# EAGLE schematic tsar_SensorFrontEnd (EAGLE 9.5.1)
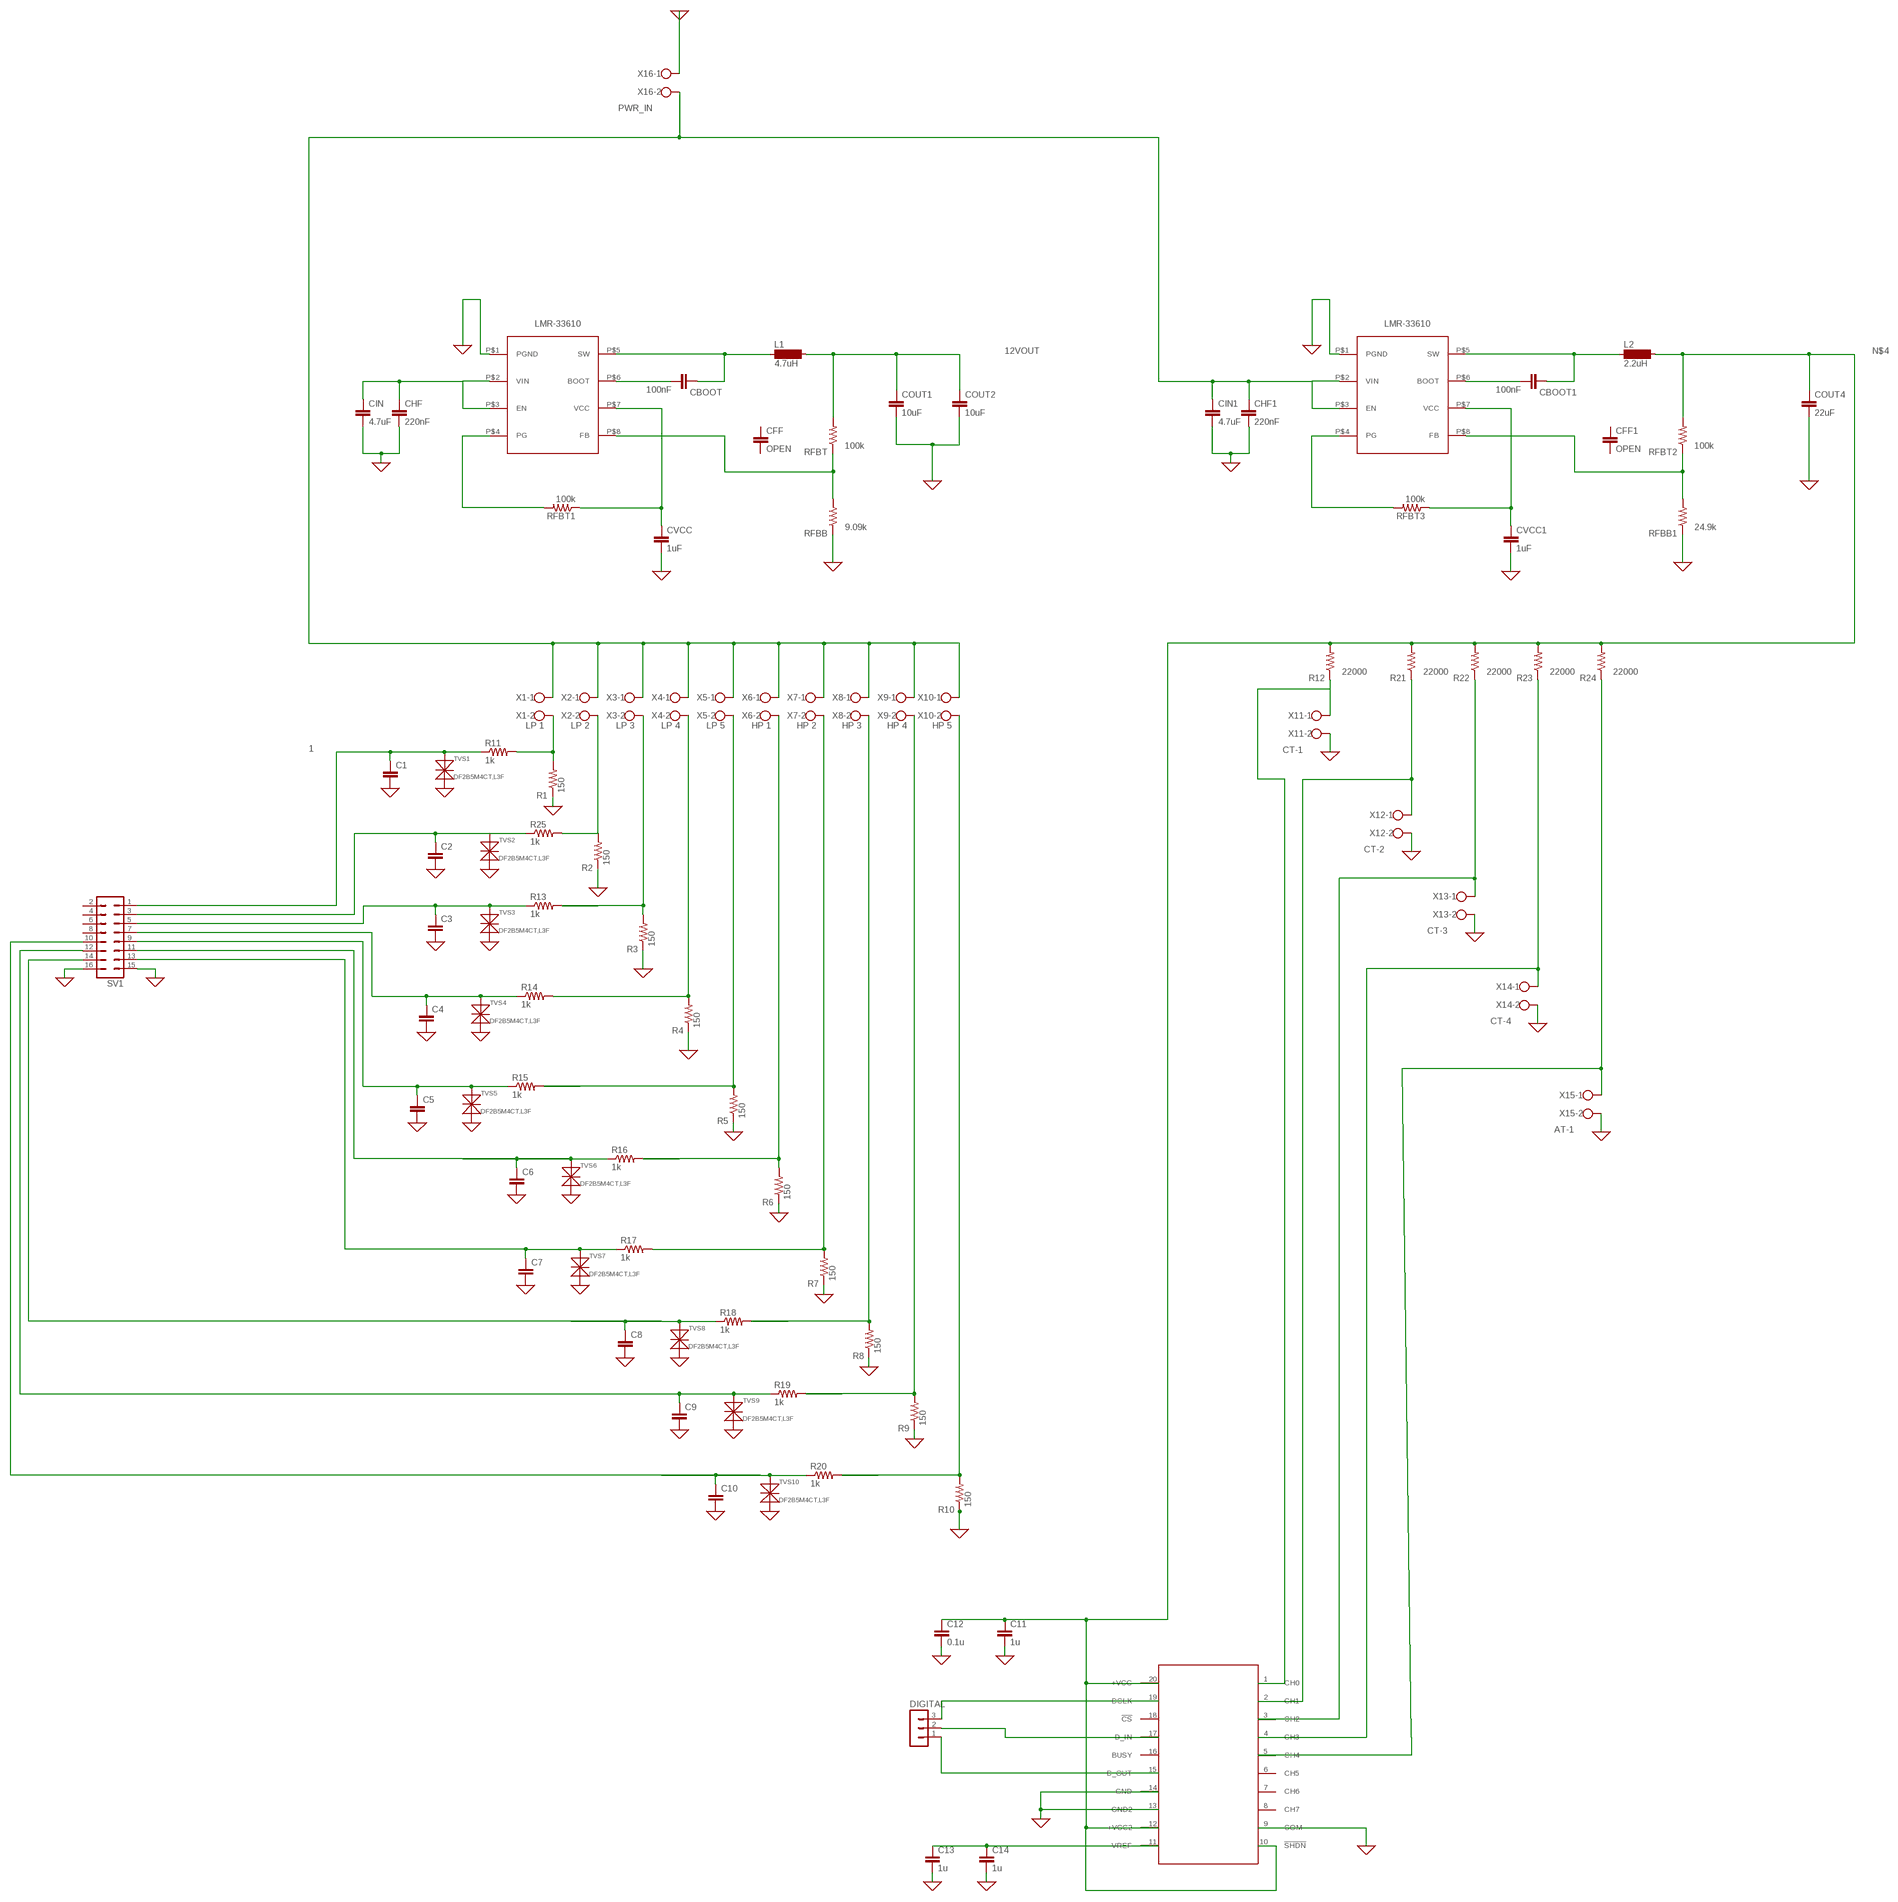
[diagram p0: schematic, sheet 1]

## Parts
C1  C-EUC0805  [C0805]
C2  C-EUC0805  [C0805]
C3  C-EUC0805  [C0805]
C4  C-EUC0805  [C0805]
C5  C-EUC0805  [C0805]
C6  C-EUC0805  [C0805]
C7  C-EUC0805  [C0805]
C8  C-EUC0805  [C0805]
C9  C-EUC0805  [C0805]
C10  C-EUC0805  [C0805]
C11  1u  C-EUC0805K  [C0805K]
C12  0.1u  C-EUC0805K  [C0805K]
C13  1u  C-EUC0805K  [C0805K]
C14  1u  C-EUC0805K  [C0805K]
CBOOT  100nF  C-EUC0402  [C0402]
CBOOT1  100nF  C-EUC0402  [C0402]
CFF  OPEN  C-EUC0402  [C0402]
CFF1  OPEN  C-EUC0402  [C0402]
CHF  220nF  C-EUC0402  [C0402]
CHF1  220nF  C-EUC0402  [C0402]
CIN  4.7uF  C-EUC0402  [C0402]
CIN1  4.7uF  C-EUC0402  [C0402]
COUT1  10uF  C-EUC0402  [C0402]
COUT2  10uF  C-EUC0402  [C0402]
COUT4  22uF  C-EUC0402  [C0402]
CVCC  1uF  C-EUC0402  [C0402]
CVCC1  1uF  C-EUC0402  [C0402]
DIGITAL  MA03-1  [MA03-1]
L1  4.7uH  SM-1206  [SM-1206]
L2  2.2uH  SM-1206  [SM-1206]
R1  150  R-US_0207/2V  [0207/2V]
R2  150  R-US_0207/2V  [0207/2V]
R3  150  R-US_0207/2V  [0207/2V]
R4  150  R-US_0207/2V  [0207/2V]
R5  150  R-US_0207/2V  [0207/2V]
R6  150  R-US_0207/2V  [0207/2V]
R7  150  R-US_0207/2V  [0207/2V]
R8  150  R-US_0207/2V  [0207/2V]
R9  150  R-US_0207/2V  [0207/2V]
R10  150  R-US_0207/2V  [0207/2V]
R11  1k  R-US_R0603  [R0603]
R12  22000  R-US_0207/2V  [0207/2V]
R13  1k  R-US_R0603  [R0603]
R14  1k  R-US_R0603  [R0603]
R15  1k  R-US_R0603  [R0603]
R16  1k  R-US_R0603  [R0603]
R17  1k  R-US_R0603  [R0603]
R18  1k  R-US_R0603  [R0603]
R19  1k  R-US_R0603  [R0603]
R20  1k  R-US_R0603  [R0603]
R21  22000  R-US_0207/2V  [0207/2V]
R22  22000  R-US_0207/2V  [0207/2V]
R23  22000  R-US_0207/2V  [0207/2V]
R24  22000  R-US_0207/2V  [0207/2V]
R25  1k  R-US_R0603  [R0603]
RFBB  9.09k  R-US_R0402  [R0402]
RFBB1  24.9k  R-US_R0402  [R0402]
RFBT  100k  R-US_R0402  [R0402]
RFBT1  100k  R-US_R0402  [R0402]
RFBT2  100k  R-US_R0402  [R0402]
RFBT3  100k  R-US_R0402  [R0402]
SV1  16PL  [16PL]
TVS1  DF2B5M4CT,L3F  [SOD-882(SOT2)]
TVS2  DF2B5M4CT,L3F  [SOD-882(SOT2)]
TVS3  DF2B5M4CT,L3F  [SOD-882(SOT2)]
TVS4  DF2B5M4CT,L3F  [SOD-882(SOT2)]
TVS5  DF2B5M4CT,L3F  [SOD-882(SOT2)]
TVS6  DF2B5M4CT,L3F  [SOD-882(SOT2)]
TVS7  DF2B5M4CT,L3F  [SOD-882(SOT2)]
TVS8  DF2B5M4CT,L3F  [SOD-882(SOT2)]
TVS9  DF2B5M4CT,L3F  [SOD-882(SOT2)]
TVS10  DF2B5M4CT,L3F  [SOD-882(SOT2)]
U$1  LMR-33610  [LMR-33610]
U$2  LMR-33610  [LMR-33610]
U$3  ADS8344  [SSOP-20]
X1  LP 1  W239-302  [W239-302]
X2  LP 2  W239-302  [W239-302]
X3  LP 3  W239-302  [W239-302]
X4  LP 4  W239-302  [W239-302]
X5  LP 5  W239-302  [W239-302]
X6  HP 1  W239-302  [W239-302]
X7  HP 2  W239-302  [W239-302]
X8  HP 3  W239-302  [W239-302]
X9  HP 4  W239-302  [W239-302]
X10  HP 5  W239-302  [W239-302]
X11  CT-1  W239-302  [W239-302]
X12  CT-2  W239-302  [W239-302]
X13  CT-3  W239-302  [W239-302]
X14  CT-4  W239-302  [W239-302]
X15  AT-1  W239-302  [W239-302]
X16  PWR_IN  W239-302  [W239-302]

## Nets
0: C1.2 C2.2 C3.2 C4.2 C5.2 C6.2 C7.2 C8.2 C9.2 C10.2 SV1.15 SV1.16 TVS1.P$2 TVS2.P$2 TVS3.P$2 TVS4.P$2 TVS5.P$2 TVS6.P$2 TVS7.P$2 TVS8.P$2 TVS9.P$2 TVS10.P$2 X11.2 X16.1 ; supply symbol labelled GND
1: C1.1 R11.1 SV1.1 TVS1.P$1
2: SV1.3
3: C3.1 R13.1 SV1.5 TVS3.P$1
4: C4.1 R14.1 SV1.7 TVS4.P$1
5: C5.1 R15.1 TVS5.P$1
6: C6.1 R16.1 TVS6.P$1
7: C7.1 R17.1 SV1.13 TVS7.P$1
8: C8.1 R18.1 TVS8.P$1
9: C9.1 R19.1 TVS9.P$1
10: C10.1 R20.1 TVS10.P$1
11: R25.1 TVS2.P$1
12: C2.1
12VOUT: CHF1.1 CIN1.1 U$2.P$2(VIN) U$2.P$3(EN) X1.1 X2.1 X3.1 X4.1 X5.1 X6.1 X7.1 X8.1 X9.1 X10.1 X16.2
GND: C11.2 C12.2 C13.2 C14.2 CHF1.2 CHF.2 CIN1.2 CIN.2 COUT1.2 COUT2.2 COUT4.2 CVCC1.2 CVCC.2 R1.1 R2.1 R3.1 R4.1 R5.1 R6.1 R7.1 R8.1 R9.1 RFBB1.1 RFBB.1 U$1.P$1(PGND) U$2.P$1(PGND) U$3.9(COM) U$3.13(GND2) U$3.14(GND) X12.2 X13.2 X14.2 X15.2
GND1: R12.1 U$3.1(CH0) X11.1
GND2: R21.1 U$3.2(CH1) X12.1
GND3: R22.1 U$3.3(CH2) X13.1
GND4: R23.1 U$3.4(CH3) X14.1
GND5: R24.1 U$3.5(CH4) X15.1
N$1 [New Class]: R4.2 R14.2 X4.2
N$2: R2.2 X2.2
N$3: R6.2 X6.2
N$4: C11.1 C12.1 COUT4.1 L2.2 R12.2 R21.2 R22.2 R23.2 R24.2 RFBT2.2 U$3.10(!SHDN) U$3.12(+VCC2) U$3.20(+VCC)
N$5: DIGITAL.3 U$3.19(DCLK)
N$6: R8.2 X8.2
N$7: X9.2
N$8: R10.2 X10.2
N$9: CBOOT.1 L1.1 U$1.P$5(SW)
N$10: CBOOT.2 U$1.P$6(BOOT)
N$11: CBOOT1.1 L2.1 U$2.P$5(SW)
N$12: CVCC.1 RFBT1.1 U$1.P$7(VCC)
N$13: RFBB.2 RFBT.1 U$1.P$8(FB)
N$14: RFBT1.2 U$1.P$4(PG)
N$15: CBOOT1.2 U$2.P$6(BOOT)
N$16: RFBB1.2 RFBT2.1 U$2.P$8(FB)
N$17: CVCC1.1 RFBT3.1 U$2.P$7(VCC)
N$18: RFBT3.2 U$2.P$4(PG)
N$19: R1.2 R11.2 X1.2
N$20: C13.1 C14.1 U$3.11(VREF)
N$21: R25.2
N$22: R3.2 R13.2 X3.2
N$23: DIGITAL.1 U$3.15(D_OUT)
N$24: DIGITAL.2 U$3.17(D_IN)
N$25: CHF.1 CIN.1 U$1.P$2(VIN) U$1.P$3(EN)
N$26: R9.2 R10.1
N$27: COUT1.1 COUT2.1 L1.2 RFBT.2
N$29: R5.2 R15.2 X5.2
N$31: SV1.9
N$32: SV1.11
N$34: SV1.14
N$35: SV1.12
N$36: SV1.10
N$38: R16.2
N$40: R7.2 R17.2 X7.2
N$42: R18.2
N$44: R19.2
N$46: R20.2
Unconnected: CFF1.1 CFF1.2 CFF.1 CFF.2 SV1.2 SV1.4 SV1.6 SV1.8 U$3.6(CH5) U$3.7(CH6) U$3.8(CH7) U$3.16(BUSY) U$3.18(!CS)

## Library data of the parts
C1-C14 CBOOT CBOOT1 CFF CFF1 CHF CHF1 CIN CIN1 COUT1 COUT2 COUT4 CVCC CVCC1 = rcl:C-EU: CAPACITOR, European symbol; SPICEPREFIX: C
DIGITAL = con-lstb:MA03-1: PIN HEADER; OC_FARNELL: unknown; OC_NEWARK: unknown
L1 L2 = inductor-neosid:SM-1206: INDUCTOR SMD chip inductor; OC_FARNELL: unknown; OC_NEWARK: unknown
R1-R25 RFBB RFBB1 RFBT RFBT1-RFBT3 = rcl:R-US_: RESISTOR, American symbol; SPICEPREFIX: R
SV1 = con-dil:16PL: DIL CABLE CONNECTOR
TVS1-TVS10 = TSAR_Controller:DF2B5M4CT,L3F
U$1 U$2 = LMR33610:LMR-33610
U$3 = TSAR_Controller:ADS8344
X1-X16 = con-wago-500:W239-302: WAGO SCREW CLAMP; OC_FARNELL: unknown; OC_NEWARK: unknown